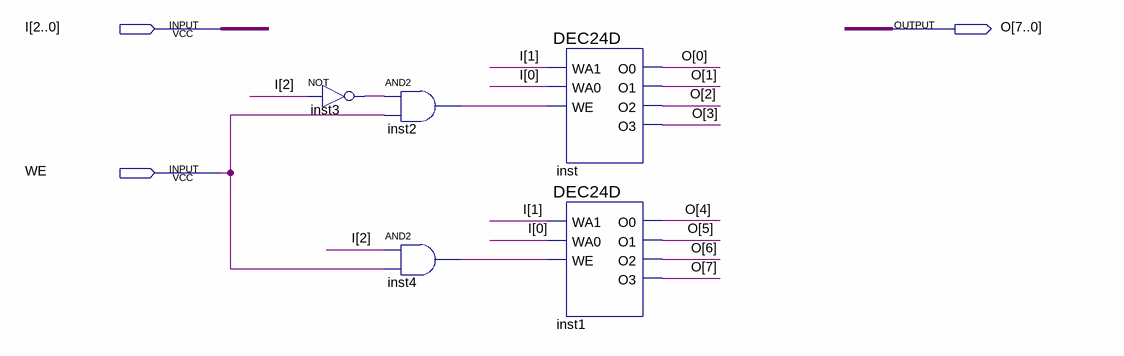
[diagram p0: schematic sheet]
// Quartus schematic DEC38D.bdf as structural Verilog: 5 symbols, 3 pins
module DEC38D (
  input  [2:0] I,
  input  WE,
  output [7:0] O
);

  wire inst2_out, inst3_out, inst4_out;

  not inst3 (inst3_out, I[2]);
  and inst2 (inst2_out, inst3_out, WE);
  and inst4 (inst4_out, I[2], WE);
  DEC24D inst (.WA1(I[1]), .WA0(I[0]), .WE(inst2_out), .O0(O[0]), .O1(O[1]), .O2(O[2]), .O3(O[3]));
  DEC24D inst1 (.WA1(I[1]), .WA0(I[0]), .WE(inst4_out), .O0(O[4]), .O1(O[5]), .O2(O[6]), .O3(O[7]));
endmodule
